# EAGLE design theremin_go_2024 (EAGLE 9.6.2)
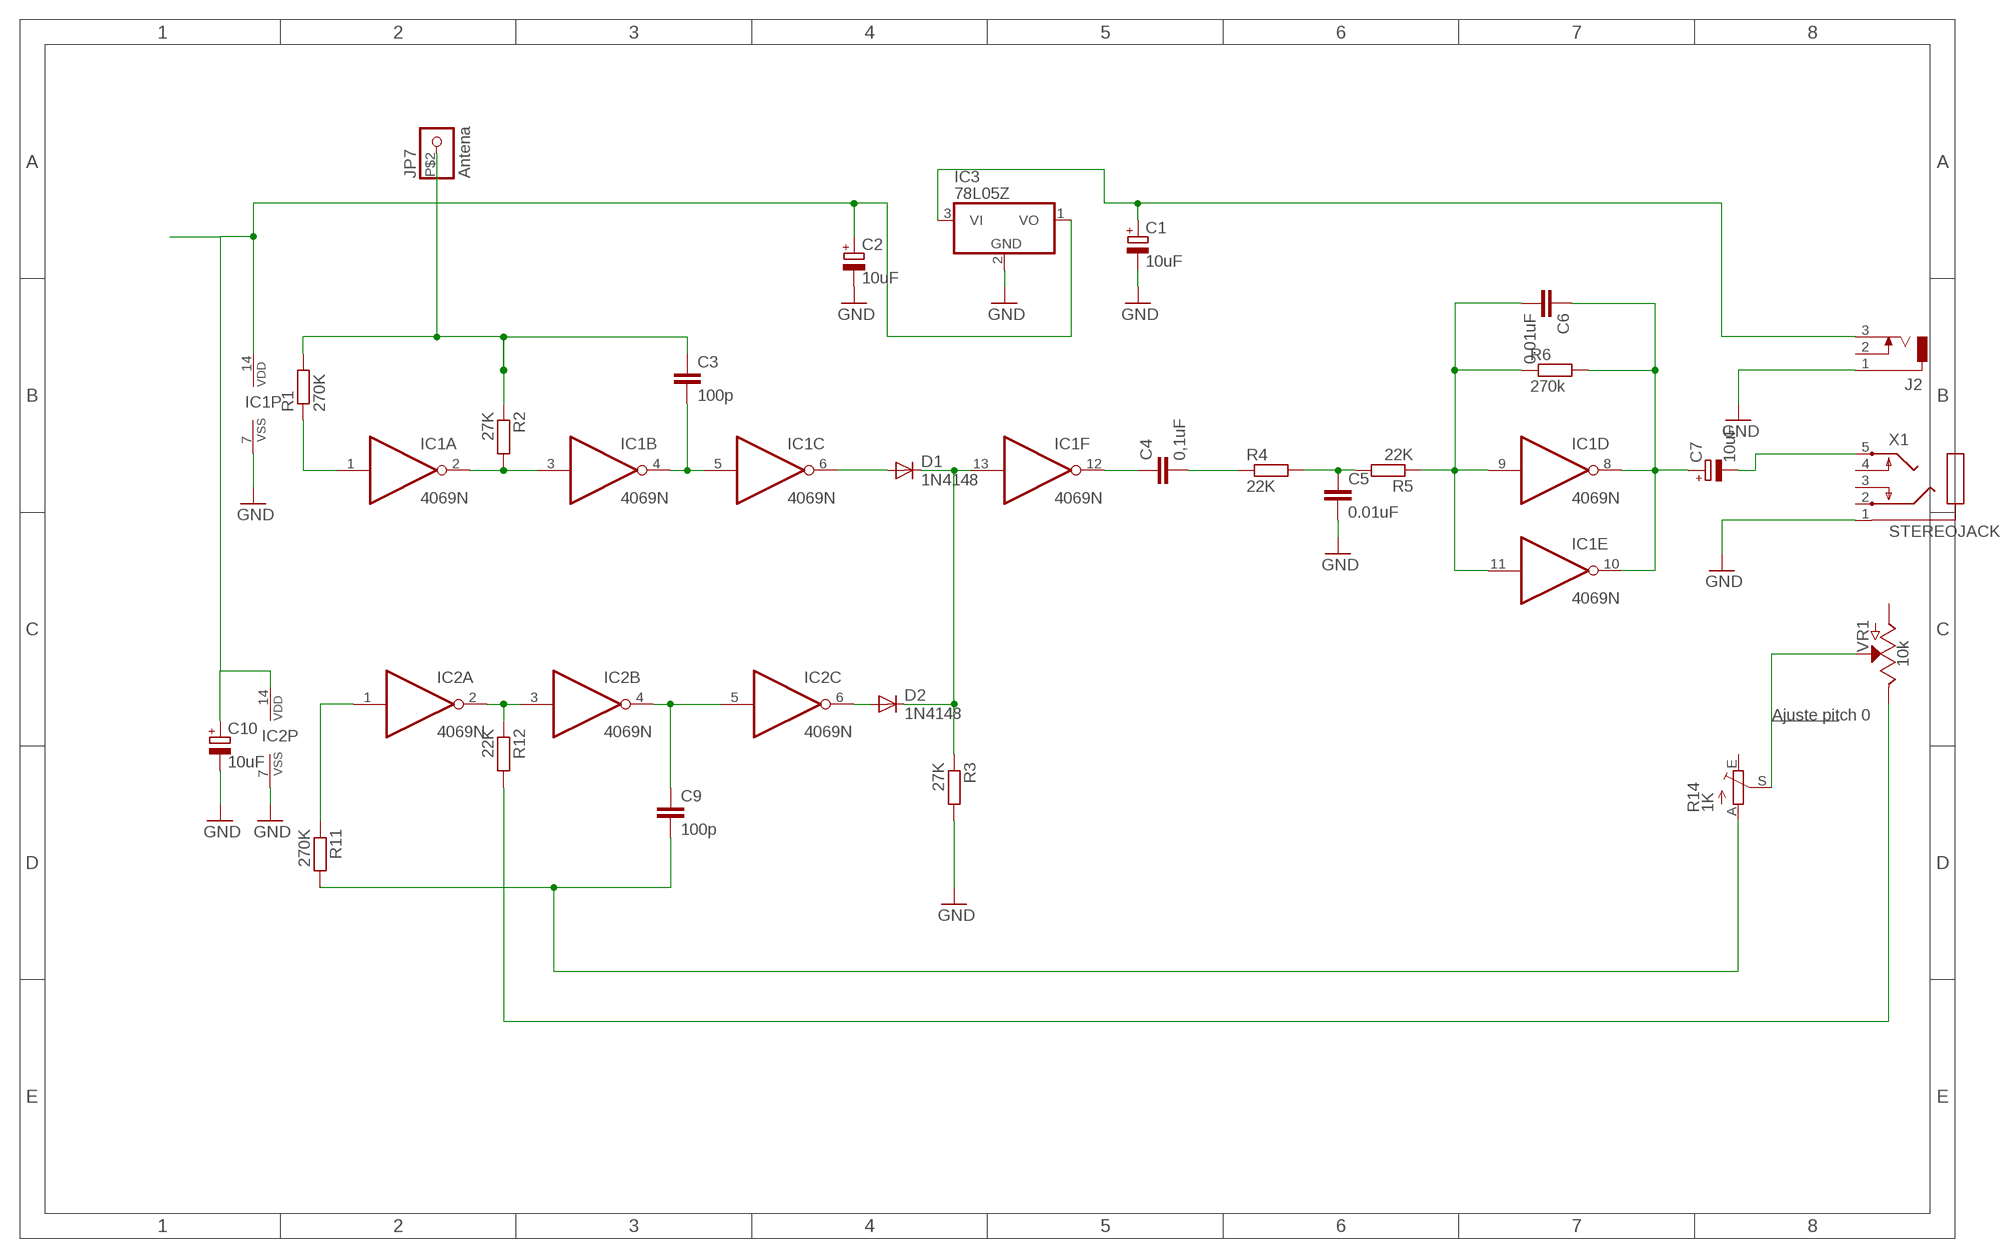
[diagram p0: schematic, sheet 1]

## Parts
C1  10uF  CPOL-EUE2,5-6E  [E2,5-6E]
C2  10uF  CPOL-EUE2,5-6E  [E2,5-6E]
C3  100p  C-EU050-030X075  [C050-030X075]
C4  0,1uF  C-EU050-030X075  [C050-030X075]
C5  0.01uF  C-EU050-030X075  [C050-030X075]
C6  0.01uF  C-EU050-030X075  [C050-030X075]
C7  10uF  CPOL-EUE2,5-6E  [E2,5-6E]
C9  100p  C-EU050-030X075  [C050-030X075]
C10  10uF  CPOL-EUE2,5-6E  [E2,5-6E]
D1  1N4148  1N4148DO35-7  [DO35-7]
D2  1N4148  1N4148DO35-7  [DO35-7]
IC1  4069N  [DIL14]
IC2  4069N  [DIL14]
IC3  78L05Z  [TO92]
J2  DCJ0303  [DCJ0303]
JP7  Antena  PINHD-1X1  [1X01]
R1  270K  R-EU_0309/10  [0309/10]
R2  27K  R-EU_0309/10  [0309/10]
R3  27K  R-EU_0309/10  [0309/10]
R4  22K  R-EU_0309/10  [0309/10]
R5  22K  R-EU_0309/10  [0309/10]
R6  270k  R-EU_0309/10  [0309/10]
R11  270K  R-EU_0309/10  [0309/10]
R12  22K  R-EU_0309/10  [0309/10]
R14  1K  TRIM_EU-S64W  [S64W]
VR1  10k  POTENTIOMETER-PTH-9MM-1/20W-20%  [POT-PTH-ALPS]
X1  STEREOJACK  [STX3100]

## Nets
GND: C1.- C2.- C5.2 C10.- IC1.7(P:VSS) IC2.7(P:VSS) IC3.2(GND) J2.1 R3.2 X1.1
N$1: C2.+ C10.+ IC1.14(P:VDD) IC2.14(P:VDD) IC3.1(VO)
N$2: C1.+ IC3.3(VI) J2.3
N$3: IC1.1(A:I) R1.1
N$4: C3.1 JP7.P$2 R1.2 R2.1
N$5: IC1.2(A:O) IC1.3(B:I) R2.2
N$6: C3.2 IC1.4(B:O) IC1.5(C:I)
N$7: D1.A IC1.6(C:O)
N$8: D1.C D2.C IC1.13(F:I) R3.1
N$9: C4.1 IC1.12(F:O)
N$10: C4.2 R4.1
N$11: C9.2 R11.2 R14.A
N$12: R14.S VR1.P$2(S)
N$13: C6.2 IC1.9(D:I) IC1.11(E:I) R5.1 R6.1
N$14: IC2.1(A:I) R11.1
N$15: C9.1 IC2.4(B:O) IC2.5(C:I)
N$17: D2.A IC2.6(C:O)
N$18: IC2.2(A:O) IC2.3(B:I) R12.1
N$20: C6.1 C7.+ IC1.8(D:O) IC1.10(E:O) R6.2
N$21: C7.- X1.5
N$22: R12.2 VR1.P$1(E)
N$23: C5.1 R4.2 R5.2
Unconnected: IC2.8(D:O) IC2.9(D:I) IC2.10(E:O) IC2.11(E:I) IC2.12(F:O) IC2.13(F:I) J2.2 R14.E VR1.P$3(A) X1.2 X1.3 X1.4

## Notes on the sheet
- Ajuste pitch 0

## Library data of the parts
C1 C2 C7 C10 = rcl:CPOL-EU: POLARIZED CAPACITOR, European symbol
C3-C6 C9 = rcl:C-EU: CAPACITOR, European symbol
D1 D2 = diode:1N4148: DIODE high speed (Philips)
IC1 IC2 = 40xx:4069: Hex INVERTER
IC3 = linear:78*: Positive VOLTAGE REGULATOR Source: http://cache.national.com/ds/LM/LM78L05.pdf http://www.fairchildsemi.com/ds/LM/LM7805.pdf
J2 = con-jack:DCJ0303: DC POWER JACK Source: DCJ0303.pdf; OC_FARNELL: unknown; OC_NEWARK: unknown
JP7 = pinhead:PINHD-1X1: PIN HEADER
R1-R6 R11 R12 = rcl:R-EU_: RESISTOR, European symbol
R14 = pot:TRIM_EU-: POTENTIOMETER
VR1 = SparkFun-Resistors:POTENTIOMETER: Potentiometer (Pot) Three-terminal potentiometers, with an adjustable wiper and two adjustable resistors. A pot can be used to create a configurable voltage divider, or as a variable resistor. Variants ALPS_POT and ALPS_POT_KIT - PTH, breadboard compatible, 9mm square pots Rotary Potentiometer - Linear (10k ohm) <https://www.sparkfun.com/products/9288> (COM-09288) The KIT variant exposes copper on only one side of the PTH pad, so the part can only be assembled on one side of the PCB. Useful for beginner soldering kits.; PROD_ID: RES-09177; SF_SKU: COM-09288
X1 = adafruit:STEREOJACK: MIC/HEADPHONE JACK Stereo jack with two switches. Kycon STX3100, CUI SJ1-3555NG and/or 4UCon 05544

## Board
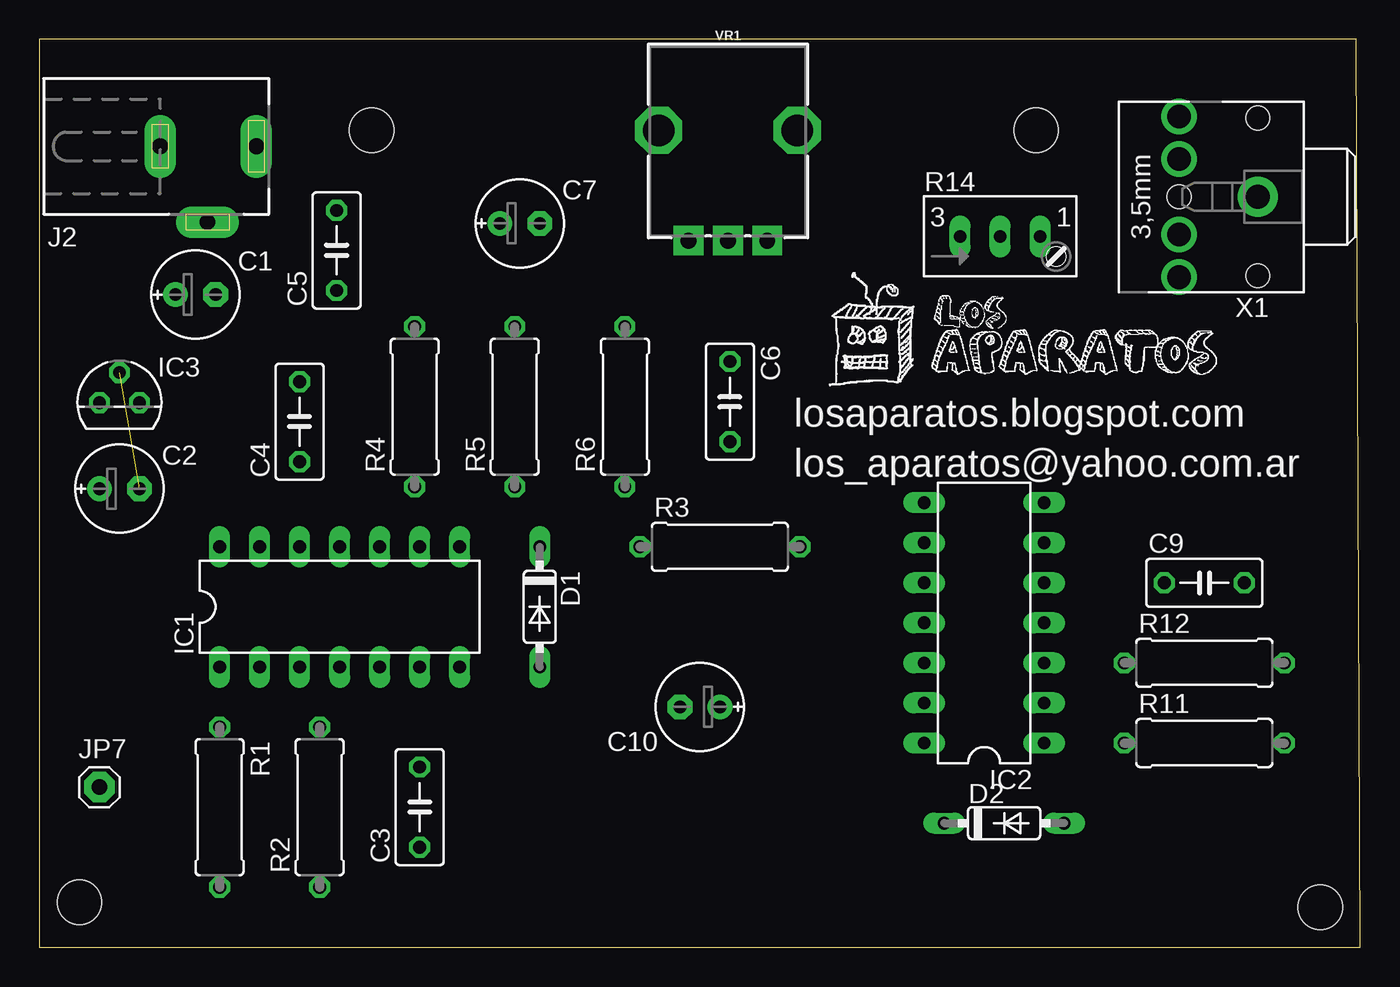
[diagram p1: board, top side]
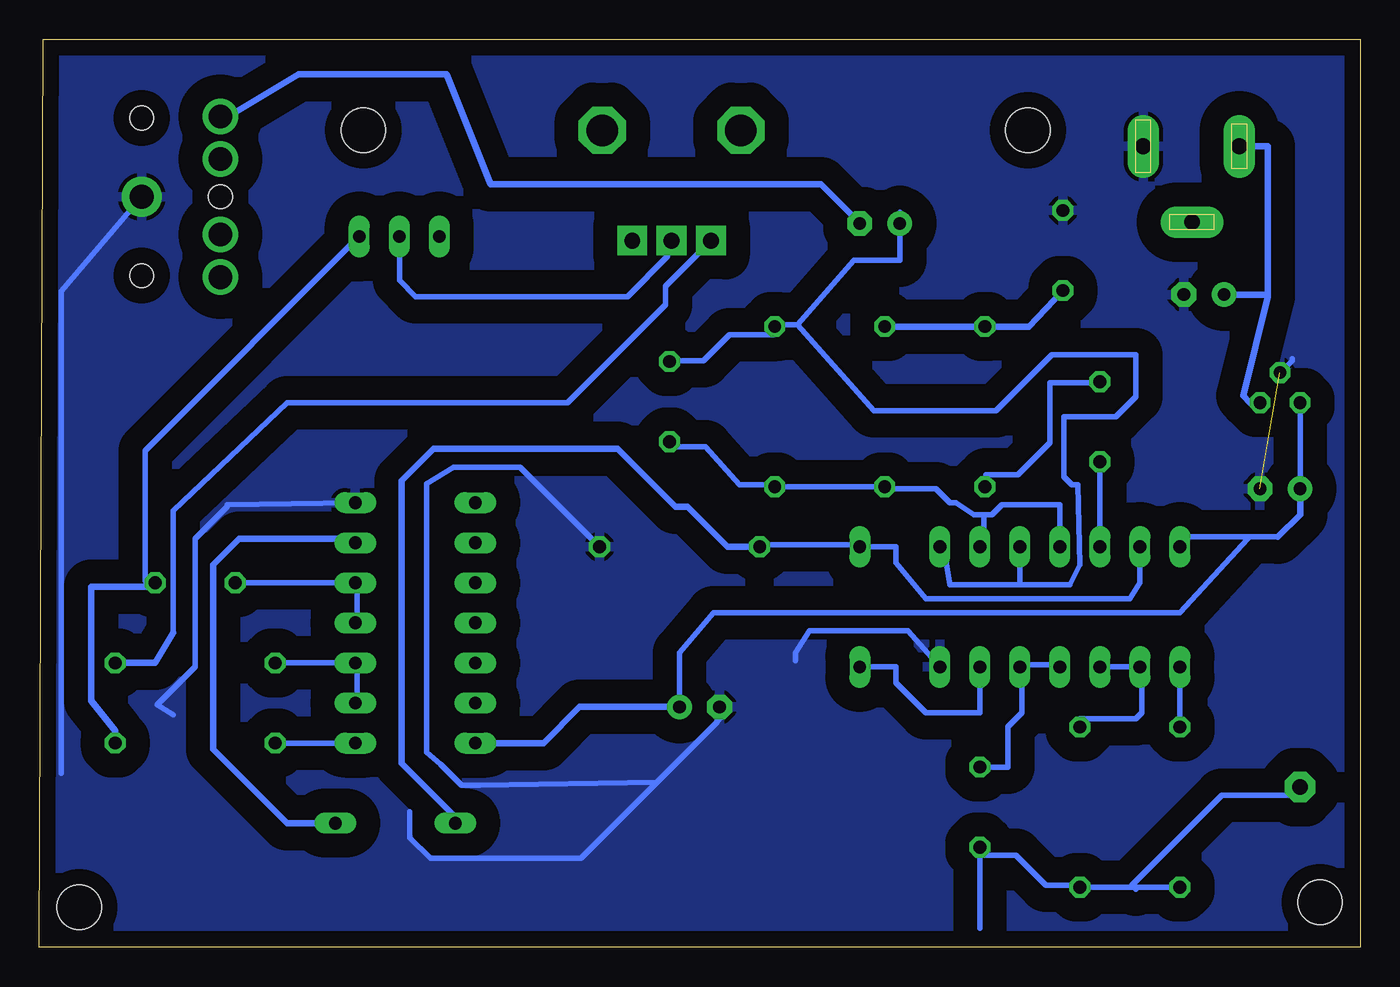
[diagram p2: board, bottom side, seen from below]

Size 83.8 x 57.58 mm. Coordinates in mm from the lower left corner, seen from the top.
Outline: 0,0 83.8,0 83.55,57.58 0,57.58 0,0
Copper layers (1*16): Top 0.035mm / dielectric 1.5mm / Bottom 0.035mm
Design rules "default *": minimum track width 14mil, minimum drill 24mil, track to track 60mil, track to pad 55mil, pad to pad 55mil, via to via 56mil, smd to smd 8mil, copper to edge 40mil, drill to drill 8mil, minimum pad ring 10mil, minimum via ring 8mil, stop-mask expansion 4mil, vias tented up to drill 0mil, thermal gap 10mil
Holes 2.8 mm at 21.08,51.82 2.54,2.86 81.28,2.54 63.25,51.82

### Footprints (pad centres in the part's own frame; a part is rotated, then mirrored left to right if it is on the bottom)
E2,5-6E = drill 0.813 pad 1.575: + -1.27,0 | drill 0.813 pad 1.575 octagon: - 1.27,0
C050-030X075 = drill 0.813 octagon: 1 -2.54,0; 2 2.54,0
DO35-7 = drill 0.813 long: A 3.81,0; C -3.81,0
DIL14 = drill 0.813 long: 1 -7.62,-3.81; 2 -5.08,-3.81; 3 -2.54,-3.81; 4 0,-3.81; 5 2.54,-3.81; 6 5.08,-3.81; 7 7.62,-3.81; 8 7.62,3.81; 9 5.08,3.81; 10 2.54,3.81; 11 0,3.81; 12 -2.54,3.81; 13 -5.08,3.81; 14 -7.62,3.81
TO92 = drill 0.813 octagon: 1 -1.27,0; 2 0,1.905; 3 1.27,0
DCJ0303 = drill 1 pad 2 long: 1 0,3.1; 2 4.8,0; 3 0,-3
1X01 = drill 1 pad 1.93 octagon: P$2 0,0
0309/10 = drill 0.813 octagon: 1 -5.08,0; 2 5.08,0
S64W = drill 0.813 long: A 2.54,1.27; E -2.54,1.27; S 0,1.27
POT-PTH-ALPS = drill 1 pad 1.88 square: P$1 7,-2.5; P$2 7,0; P$3 7,2.5 | drill 2 octagon: P$4 0,-4.4; P$5 0,4.4
STX3100 = drill 1.5 pad 2.54: 1 2.7,-0.1 | drill 1.5: 2 7.7,5; 3 7.7,2.3; 4 7.7,-2.5; 5 7.7,-5.2 | hole 1.5: 2.7,4.9; 2.7,-5.1; 7.7,-0.1

### Placement (x,y rotation side)
C1  9.91,41.4 0 top
C2  5.08,29.08 0 top
C3  24.13,8.89 90 top
C4  16.51,33.34 90 top
C5  18.86,44.2 90 top
C6  43.81,34.61 270 top
C7  30.48,45.91 0 top
C9  73.91,23.11 0 top
C10  41.91,15.24 180 top
D1  31.75,21.59 270 top
D2  61.21,7.87 0 top
IC1  19.05,21.59 0 top
IC2  59.94,20.57 90 top
IC3  5.08,34.54 0 top
J2  10.67,50.8 270 top
JP7  3.81,10.16 0 top
R1  11.43,8.89 270 top
R2  17.78,8.89 90 top
R3  43.18,25.4 0 top
R4  23.81,34.29 90 top
R5  30.16,34.29 90 top
R6  37.15,34.29 90 top
R11  73.91,12.95 0 top
R12  73.91,18.03 0 top
R14  60.96,43.81 0 top
VR1  43.69,51.82 270 top
X1  80.01,47.5 180 top

### Tracks (layer width: path | path; a pad name or v marks a point on that pad's centre or on a via)
GND  (1 unrouted)
  Bottom 0.356: IC3.2 4.32,37.21 4.32,37.34 | C10.- 40.39,14.99 40.13,14.99 | 40.13,14.99 40.39,15.24 C10.- | 60.3,8.6 60.3,6.95 58.99,5.64 49.44,5.64 44.62,10.46 | C10.- 40.82,15.06 40.82,14.3 | 40.82,14.3 40.82,14.26 44.62,10.46 | 40.82,14.3 40.13,14.99 | 44.62,10.46 55.88,10.29 57.02,10.29 58.34,11.61 59.22,12.37 59.22,29.4 57.53,30.45 53.31,30.45 R3.2 | X1.1 82.42,41.6 82.42,11.05 | IC2.7 71.88,28.07 71.88,27.94 73.91,25.91 73.91,17.78 76.33,15.37 75.31,14.73 | IC1.7 28.7,20.07 34.92,20.07 35.81,18.67 35.81,18.16
  pour Bottom (isolate 0.305): -0.32,57.72 0,0 83.82,0 84.33,58.42
N$1
  Bottom 0.356: IC1.14 11.43,26.04 7.11,26.04 | 5.21,26.04 7.11,26.04 | C2.+ IC3.1 | 7.11,26.04 7.11,25.91 11.43,21.21 41.02,21.21 43.18,18.67 C10.+
  Bottom 0.406: 5.21,26.04 3.81,27.43 C2.+ | C10.+ 49.53,15.24 51.82,12.95 IC2.14
N$2
  Bottom 0.406: IC3.3 6.99,34.54 7.42,34.98 5.84,41.27 5.84,41.4 | J2.3 5.84,50.8 5.84,41.4 | C1.+ 5.84,41.4
N$3
  Bottom 0.356: R1.1 IC1.1
N$4
  Bottom 0.356: 14.48,3.81 R2.1 17.78,3.94 19.94,3.94 21.84,5.84 24,5.84 24,6.22 C3.1 24.13,1.19 | 14.48,3.81 14.22,3.81 | 14.22,3.81 R1.2 | JP7.P$2 3.81,9.65 8.76,9.65 14.48,3.94 14.48,3.81 | 14.22,3.81 14.22,3.67
N$5
  Bottom 0.356: IC1.3 IC1.2 13.84,17.78 13.84,14.86 14.22,14.48 17.78,14.48 R2.2
N$6
  Bottom 0.356: C3.2 22.35,11.43 22.35,13.97 21.46,14.86 21.46,17.78 IC1.5 21.46,17.91 19.18,17.91 IC1.4
N$7
  Bottom 0.356: IC1.6 24.13,14.86 27.56,14.86 29.46,16.76 29.46,17.78 D1.A
N$8
  Bottom 0.356: IC1.13 13.97,23.11 14.61,22.1 27.56,22.1 29.46,24.38 29.46,25.4 D1.C 31.75,25.53 37.97,25.53 R3.1
  Bottom 0.406: D2.C 57.4,8.26 60.83,11.68 60.83,29.59 58.8,31.62 47.12,31.62 43.43,27.94 42.67,27.94 40.13,25.4 R3.1
N$9
  Bottom 0.356: IC1.12 C4.1
N$10
  Bottom 0.356: R4.1 23.75,29.21 23.75,29.97 21.72,29.97 19.68,32 19.68,35.81 16.51,35.81 C4.2
N$11
  Bottom 0.356: R14.A 77.09,31.5 77.09,23.24 76.71,22.86
  Bottom 0.406: R11.2 78.99,13.72 80.52,15.62 80.52,22.86 76.71,22.86 C9.2
N$12
  Bottom 0.356: VR1.P$2 43.94,44.82 43.94,43.81 46.48,41.27 59.94,41.27 60.96,42.29 R14.S
N$13
  Bottom 0.356: IC1.11 19.05,28.07 22.73,28.07 23.37,27.43 23.88,27.43 | 23.88,27.43 24.51,27.43 25.65,28.19 26.04,28.19 26.92,29.08 30.1,29.08 R5.1 R6.1 37.21,29.34 39.37,29.34 41.53,31.75 43.81,31.75 C6.2 | 23.88,27.43 23.88,25.4 IC1.9 | C6.2 43.81,32.26 43.31,31.75 C6.2
N$14
  Bottom 0.356: R11.1 IC2.1
N$15
  Bottom 0.356: C9.1 IC2.5 63.63,23.11 63.63,20.7 IC2.4
N$17
  Bottom 0.406: D2.A 68.07,7.87 72.77,12.57 72.77,24.26 71.12,25.91 64.01,25.91 IC2.6
N$18
  Bottom 0.356: R12.1 IC2.3 63.63,18.03 63.63,15.62 IC2.2
N$20
  Bottom 0.356: 21.59,22.99 IC1.10 | 21.59,22.99 26.04,22.99 26.29,24.51 26.54,24.51 26.67,24.64 IC1.8 | C6.1 43.81,37.21 41.66,37.21 40.01,38.86 37.21,38.86 37.21,39.37 R6.2 37.08,39.5 35.69,39.5 | 35.69,39.5 32.13,43.56 29.21,43.56 C7.+ 29.21,46.61 | 21.59,22.99 18.41,22.99 17.78,24.26 17.91,29.34 18.29,29.34 18.8,29.84 18.8,33.66 15.49,33.66 14.22,34.92 14.22,37.59 19.56,37.59 23.11,34.04 30.86,34.04 35.69,39.5
N$21
  Bottom 0.356: X1.5 72.21,52.7 72.14,52.77
  Bottom 0.406: C7.- 34.22,48.38 55.18,48.38 57.96,55.37 67.34,55.38 71.8,52.7 X1.5 | 72.39,52.77 72.14,52.77
N$22
  Bottom 0.356: VR1.P$1 44.08,41.92 44.08,40.75 50.29,34.54 68.07,34.54 75.31,27.69 75.31,19.94
  Bottom 0.406: R12.2 76.45,18.03 75.31,19.94
N$23
  Bottom 0.406: R5.2 R4.2 21.02,39.37 C5.1

### Text on the board
tNames: losaparatos.blogspot.com | los_aparatos@yahoo.com.ar